# EAGLE design Mega8 (EAGLE 7.4.0)
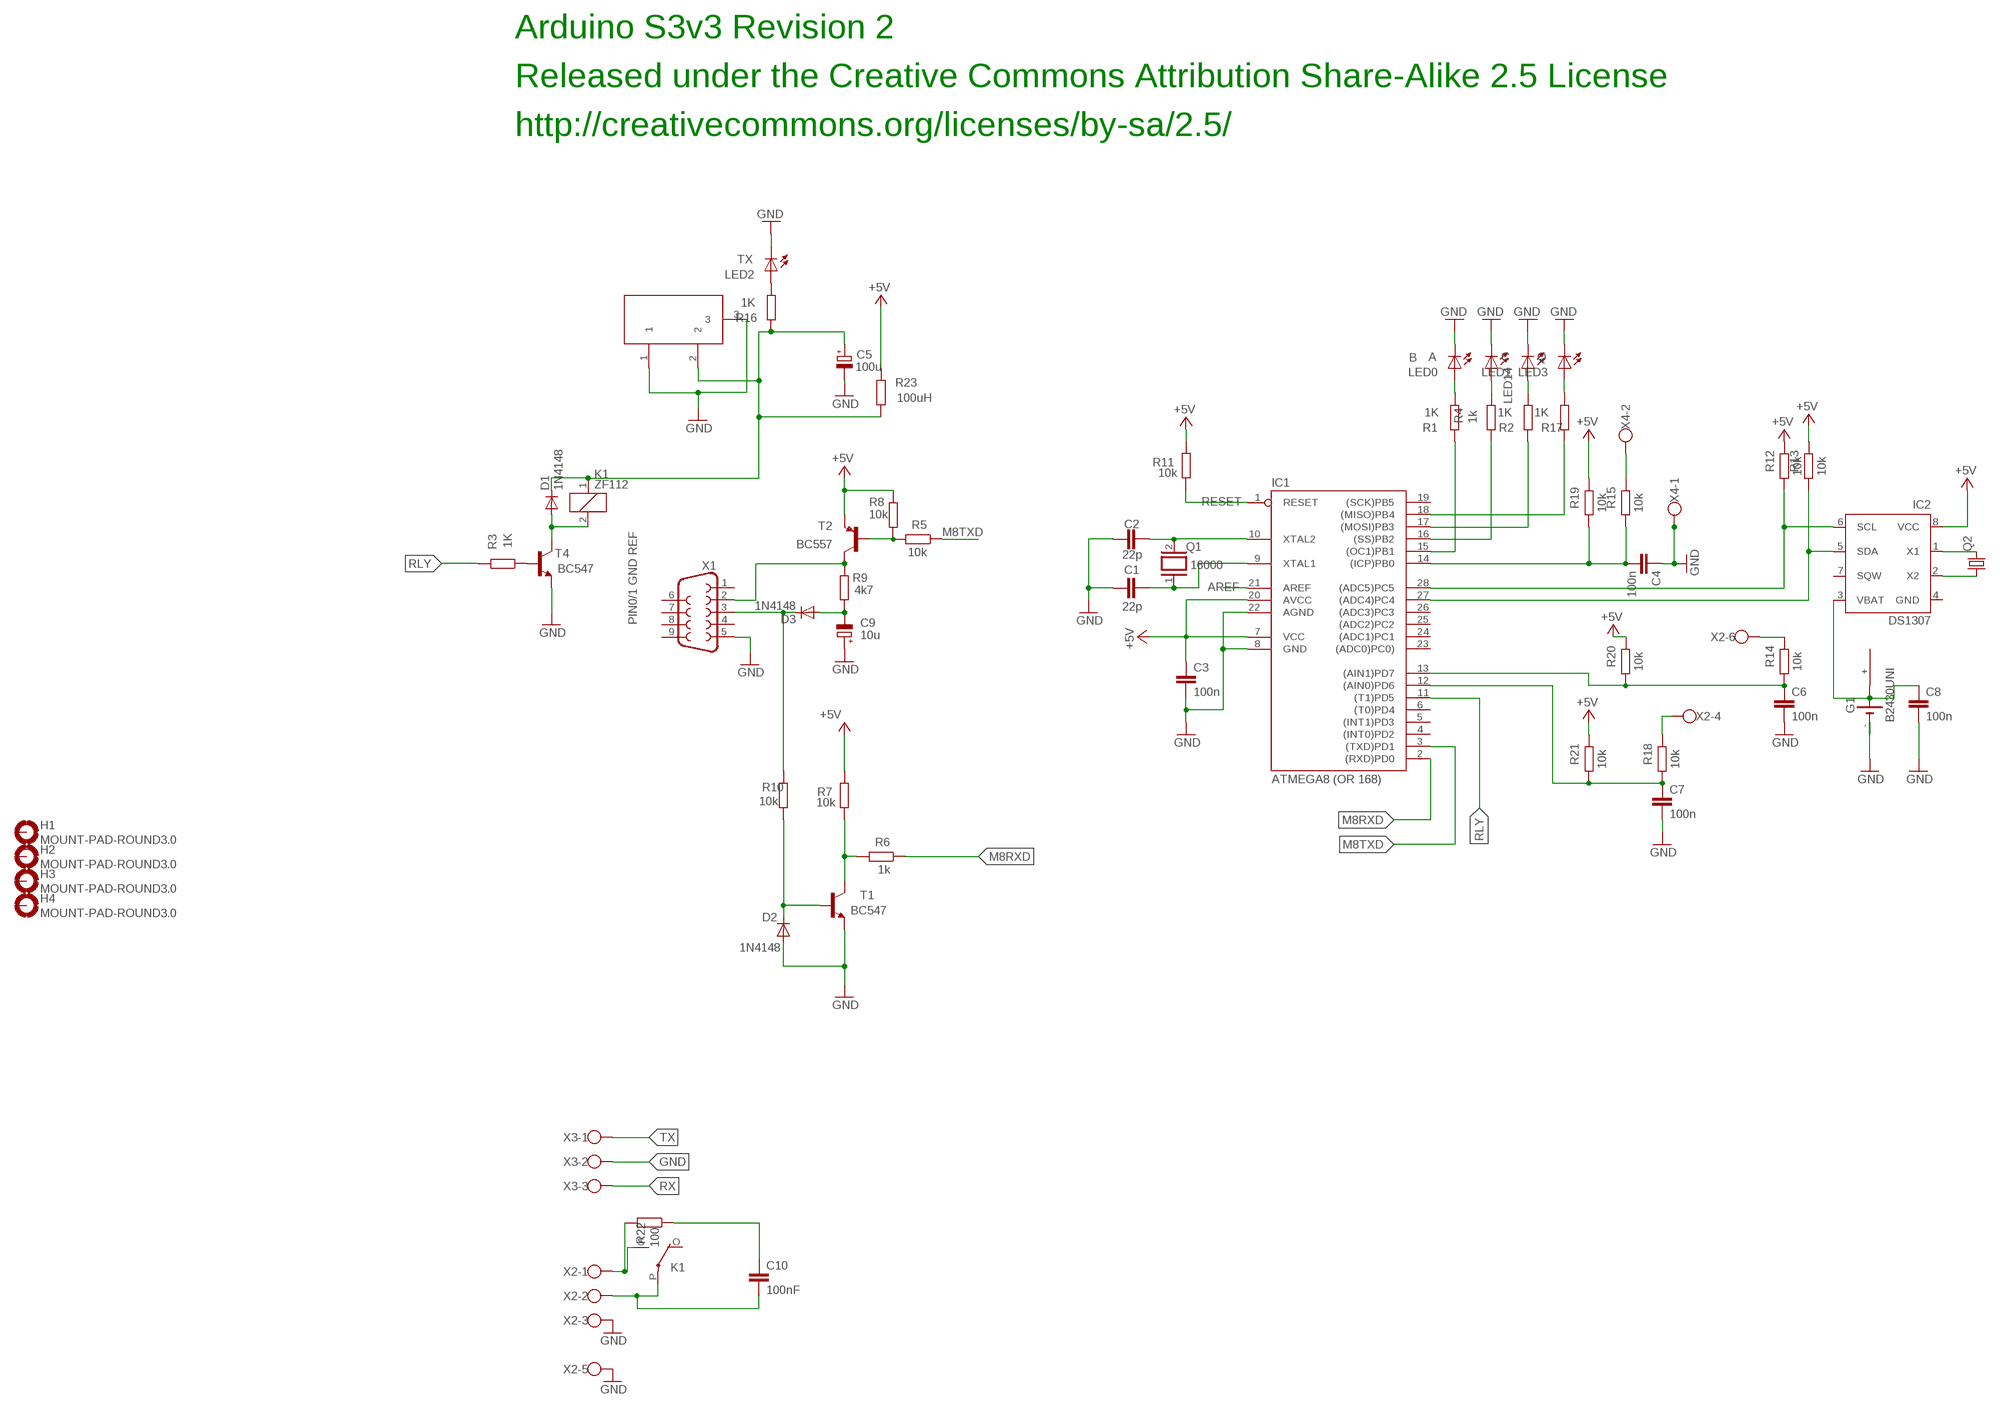
[diagram p0: schematic, sheet 1]

## Parts
C1  22p  C-EU050-025X075  [C050-025X075]
C2  22p  C-EU050-025X075  [C050-025X075]
C3  100n  C-EU050-025X075  [C050-025X075]
C4  100n  C-EU050-025X075  [C050-025X075]
C5  100u  CPOL-EUE3.5-8  [E3,5-8]
C6  100n  C-EU050-025X075  [C050-025X075]
C7  100n  C-EU050-025X075  [C050-025X075]
C8  100n  C-EU050-025X075  [C050-025X075]
C9  10u  CPOL-EUE5-6  [E5-6]
C10  100nF  C-EU102-043X133  [C102-043X133]
D1  1N4148  [DO35-10]
D2  1N4148  [DO35-10]
D3  1N4148  [DO35-10]
DC1  DC21MMX  [DC-21MM]
G1  B2430UNI  [B2430UNI]
H1  MOUNT-PAD-ROUND3.0  [3,0-PAD]
H2  MOUNT-PAD-ROUND3.0  [3,0-PAD]
H3  MOUNT-PAD-ROUND3.0  [3,0-PAD]
H4  MOUNT-PAD-ROUND3.0  [3,0-PAD]
IC1  ATMEGA8 (OR 168)  AT90S4433P  [DIL28-3]
IC2  DS1307  [DIL08]
K1  ZF112  [ZF112]
LED0  A  LED3MM  [LED3MM]
LED1  C  LED3MM  [LED3MM]
LED2  TX  LED3MM  [LED3MM]
LED3  Q  LED3MM  [LED3MM]
LED14  B  LED3MM  [LED3MM]
Q1  16000  XTAL  [Q]
Q2  CRYSTALTC26H  [TC26H]
R1  1K  R-EU_0207/10  [0207/10]
R2  1K  R-EU_0207/10  [0207/10]
R3  1K  R-EU_0207/10  [0207/10]
R4  1k  R-EU_0207/10  [0207/10]
R5  10k  R-EU_0207/10  [0207/10]
R6  1k  R-EU_0207/10  [0207/10]
R7  10k  R-EU_0207/10  [0207/10]
R8  10k  R-EU_0207/10  [0207/10]
R9  4k7  R-EU_0207/10  [0207/10]
R10  10k  R-EU_0207/10  [0207/10]
R11  10k  R-EU_0207/10  [0207/10]
R12  10k  R-EU_0207/10  [0207/10]
R13  10k  R-EU_0207/10  [0207/10]
R14  10k  R-EU_0207/10  [0207/10]
R15  10k  R-EU_0207/10  [0207/10]
R16  1K  R-EU_0207/10  [0207/10]
R17  1K  R-EU_0207/10  [0207/10]
R18  10k  R-EU_0207/10  [0207/10]
R19  10k  R-EU_0207/10  [0207/10]
R20  10k  R-EU_0207/10  [0207/10]
R21  10k  R-EU_0207/10  [0207/10]
R22  100  R-EU_0207/10  [0207/10]
R23  100uH  R-EU_0207/10  [0207/10]
T1  BC547  [TO92]
T2  BC557  BC557B-PNP-TO92-EBC  [TO92-EBC]
T4  BC547  [TO92]
X1  F09H  [F09H]
X2  W237-6  [W237-6]
X3  W237-103  [W237-103]
X4  W237-102  [W237-102]

## Nets
+5V [power]: C3.1 IC1.7(VCC) IC1.20(AVCC) IC2.8(VCC) R7.2 R8.1 R11.2 R12.1 R13.1 R19.1 R20.1 R21.1 R23.2 T2.E
AREF: IC1.21(AREF)
GND: C1.1 C2.1 C3.2 C4.1 C5.- C6.2 C7.2 C8.2 C9.+ D2.A DC1.1 DC1.3 G1.- G1.-@1(-) IC1.8(GND) IC1.22(AGND) LED0.K(C) LED1.K(C) LED2.K(C) LED3.K(C) LED14.K(C) T1.1(E) T4.1(E) X1.5 X2.3 X2.5 X3.2 X4.1
M8RXD: IC1.2((RXD)PD0) R6.1
M8TXD: IC1.3((TXD)PD1) R5.1
N$1: R3.1 T4.2(B)
N$2: C9.- D3.A R9.1
N$3: LED14.A R4.1
N$4: D1.A K1.2 T4.3(C)
N$5: R18.1 X2.4
N$6: C1.2 IC1.9(XTAL1) Q1.1
N$7: C2.2 IC1.10(XTAL2) Q1.2
N$8: K1.S(2:S) R22.2 X2.1
N$9: C10.2 K1.P(2:P) X2.2
N$10: IC1.28((ADC5)PC5) IC2.6(SCL) R12.2
N$11: IC1.27((ADC4)PC4) IC2.5(SDA) R13.2
N$12: C8.1 G1.+@4(+) IC2.3(VBAT)
N$13: C4.2 IC1.14((ICP)PB0) R15.2 R19.2
N$14: C6.1 IC1.13((AIN1)PD7) R14.2 R20.2
N$15: R14.1 X2.6
N$16: IC1.15((OC1)PB1) R1.2
N$17: IC1.16((SS)PB2) R4.2
N$18: IC1.17((MOSI)PB3) R2.2
N$19: LED2.A R16.1
N$20: C7.1 IC1.12((AIN0)PD6) R18.2 R21.2
N$21: LED3.A R17.1
N$22: IC1.18((MISO)PB4) R17.2
N$23: R15.1 X4.2
N$24: IC2.1(X1) Q2.2
N$25: IC2.2(X2) Q2.1
N$26: R6.2 R7.1 T1.3(C)
N$27: R5.2 R8.2 T2.B
N$28: C10.1 R22.1
N$29: D2.C R10.1 T1.2(B)
N$30 [power]: C5.+ D1.C DC1.2 K1.1 R16.2 R23.1
N$32: LED1.A R2.1
N$33: LED0.A R1.1
RESET: IC1.1(RESET) R11.1
RLY: IC1.11((T1)PD5) R3.2
RX: D3.C R10.2 X1.3 X3.3
TX: R9.2 T2.C X1.2 X3.1
Unconnected: G1.+ G1.+@1(+) G1.+@2(+) G1.+@3(+) H1.B3,0(MOUNT) H2.B3,0(MOUNT) H3.B3,0(MOUNT) H4.B3,0(MOUNT) IC1.4((INT0)PD2) IC1.5((INT1)PD3) IC1.6((T0)PD4) IC1.19((SCK)PB5) IC1.23((ADC0)PC0)) IC1.24((ADC1)PC1) IC1.25((ADC2)PC2) IC1.26((ADC3)PC3) IC2.7(SQW) K1.O(2:O) X1.1 X1.4 X1.6 X1.7 X1.8 X1.9

## Notes on the sheet
- Arduino S3v3 Revision 2
- Released under the Creative Commons Attribution Share-Alike 2.5 License
- http://creativecommons.org/licenses/by-sa/2.5/
- PIN0/1 GND REF

## Power pins joined to a net without a drawn wire
GND: IC2.4(GND)

## Library data of the parts
C1-C4 C6-C8 C10 = rcl:C-EU: CAPACITOR, European symbol
C5 C9 = rcl:CPOL-EU: POLARIZED CAPACITOR, European symbol
D1-D3 = diode:1N4148: DIODE high speed (Philips)
DC1 = powersupply:DC21MM
G1 = battery:B2430UNI: LI BATTERY
H1-H4 = holes:MOUNT-PAD-ROUND: MOUNTING PAD, round
IC1 = atmel:AT90S4433: MICROCONTROLLER 4 Kbytes FLASH 128 bytes SRAM 256 bytes EEPROM UART 6-channel 10 bit ADC
IC2 = ds1307_pcf8583:DS1307: I2C-Bus CLOCK/CALENDAR
K1 = relay:ZF112: RELAY 1 x switch; OC_FARNELL: unknown; OC_NEWARK: unknown
LED0 LED1-LED3 LED14 = led:LED: LED OSRAM: - CHIPLED LG R971, LG N971, LY N971, LG Q971, LY Q971, LO R971, LY R971 LH N974, LH R974 LS Q976, LO Q976, LY Q976 LO Q996 - Hyper CHIPLED LW Q18S LB Q993, LB Q99A, LB R99A - SideLED LS A670, LO A670, LY A670, LG A670, LP A670 LB A673, LV A673, LT A673, LW A673 LH A674 LY A675 LS A676, LA A676, LO A676, LY A676, LW A676 LS A679, LY A679, LG A679 - Hyper Micro SIDELED® LS Y876, LA Y876, LO Y876, LY Y876 LT Y87S - SmartLED LW L88C, LW L88S LB L89C, LB L89S, LG L890 LS L89K, LO L89K, LY L89K LS L896, LA L896, LO L896, LY L896 - TOPLED LS T670, LO T670, LY T670, LG T670, LP T670 LSG T670, LSP T670, LSY T670, LOP T670, LYG T670 LG T671, LOG T671, LSG T671 LB T673, LV T673, LT T673, LW T673 LH T674 LS T676, LA T676, LO T676, LY T676, LB T676, LH T676, LSB T676, LW T676 LB T67C, LV T67C, LT T67C, LS T67K, LO T67K, LY T67K, LW E67C LS E67B, LA E67B, LO E67B, LY E67B, LB E67C, LV E67C, LT E67C LW T67C LS T679, LY T679, LG T679 LS T770, LO T770, LY T770, LG T770, LP T770 LB T773, LV T773, LT T773, LW T773 LH T774 LS E675, LA E675, LY E675, LS T675 LS T776, LA T776, LO T776, LY T776, LB T776 LHGB T686 LT T68C, LB T68C - Hyper Mini TOPLED® LB M676 - Mini TOPLED Santana® LG M470 LS M47K, LO M47K, LY M47K Source: http://www.osram.convergy.de/
Q1 = special:XTAL: CRYSTAL
Q2 = crystal:CRYSTAL: CRYSTAL; OC_FARNELL: unknown; OC_NEWARK: unknown
R1-R23 = rcl:R-EU_: RESISTOR, European symbol
T1 T4 = transistor:BC547: NPN TRANSISTOR
T2 = transistor:*-PNP-: PNP Transistror
X1 = con-subd:F09: SUB-D
X2 = con-wago-500:W237-6: WAGO SCREW CLAMP; OC_FARNELL: unknown; OC_NEWARK: unknown
X3 = con-wago-500:W237-103: WAGO SCREW CLAMP; MPN: 237-103; OC_FARNELL: unknown; OC_NEWARK: 18M7116
X4 = con-wago-500:W237-102: WAGO SCREW CLAMP; MPN: 237-102; OC_FARNELL: unknown; OC_NEWARK: 70K9898

## Net classes
1 power: width 0.61 mm

## Board
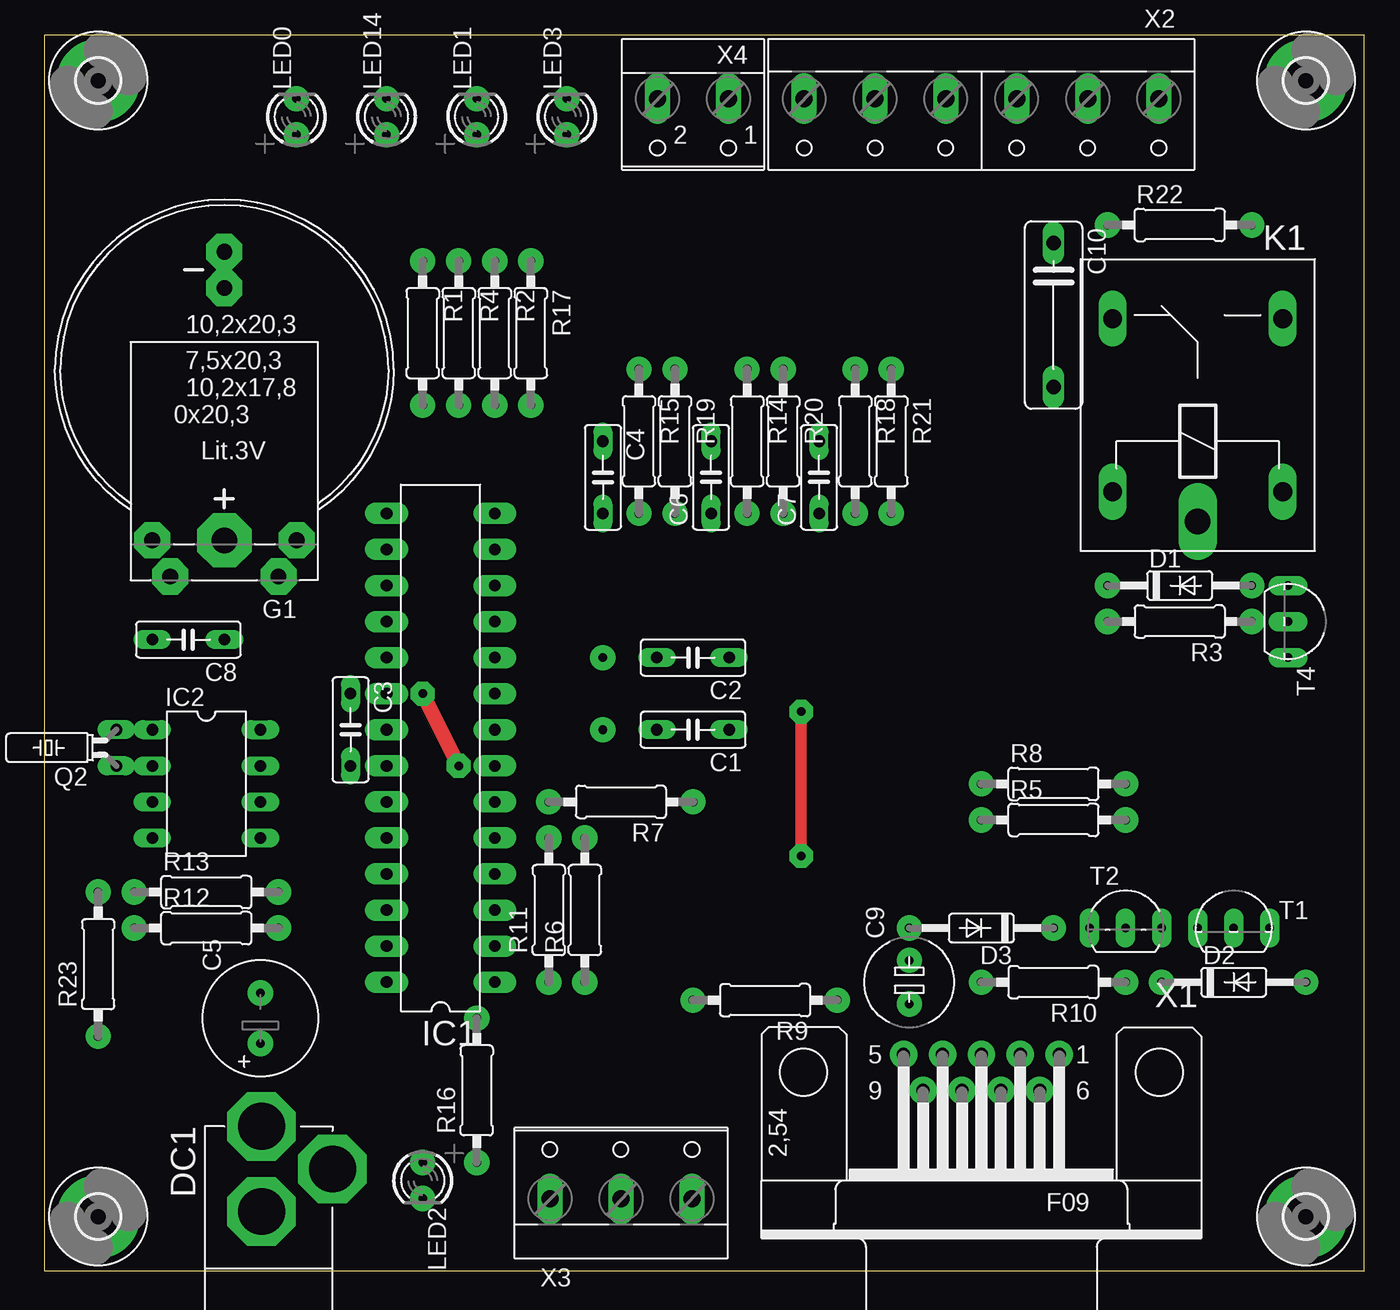
[diagram p1: board, top side]
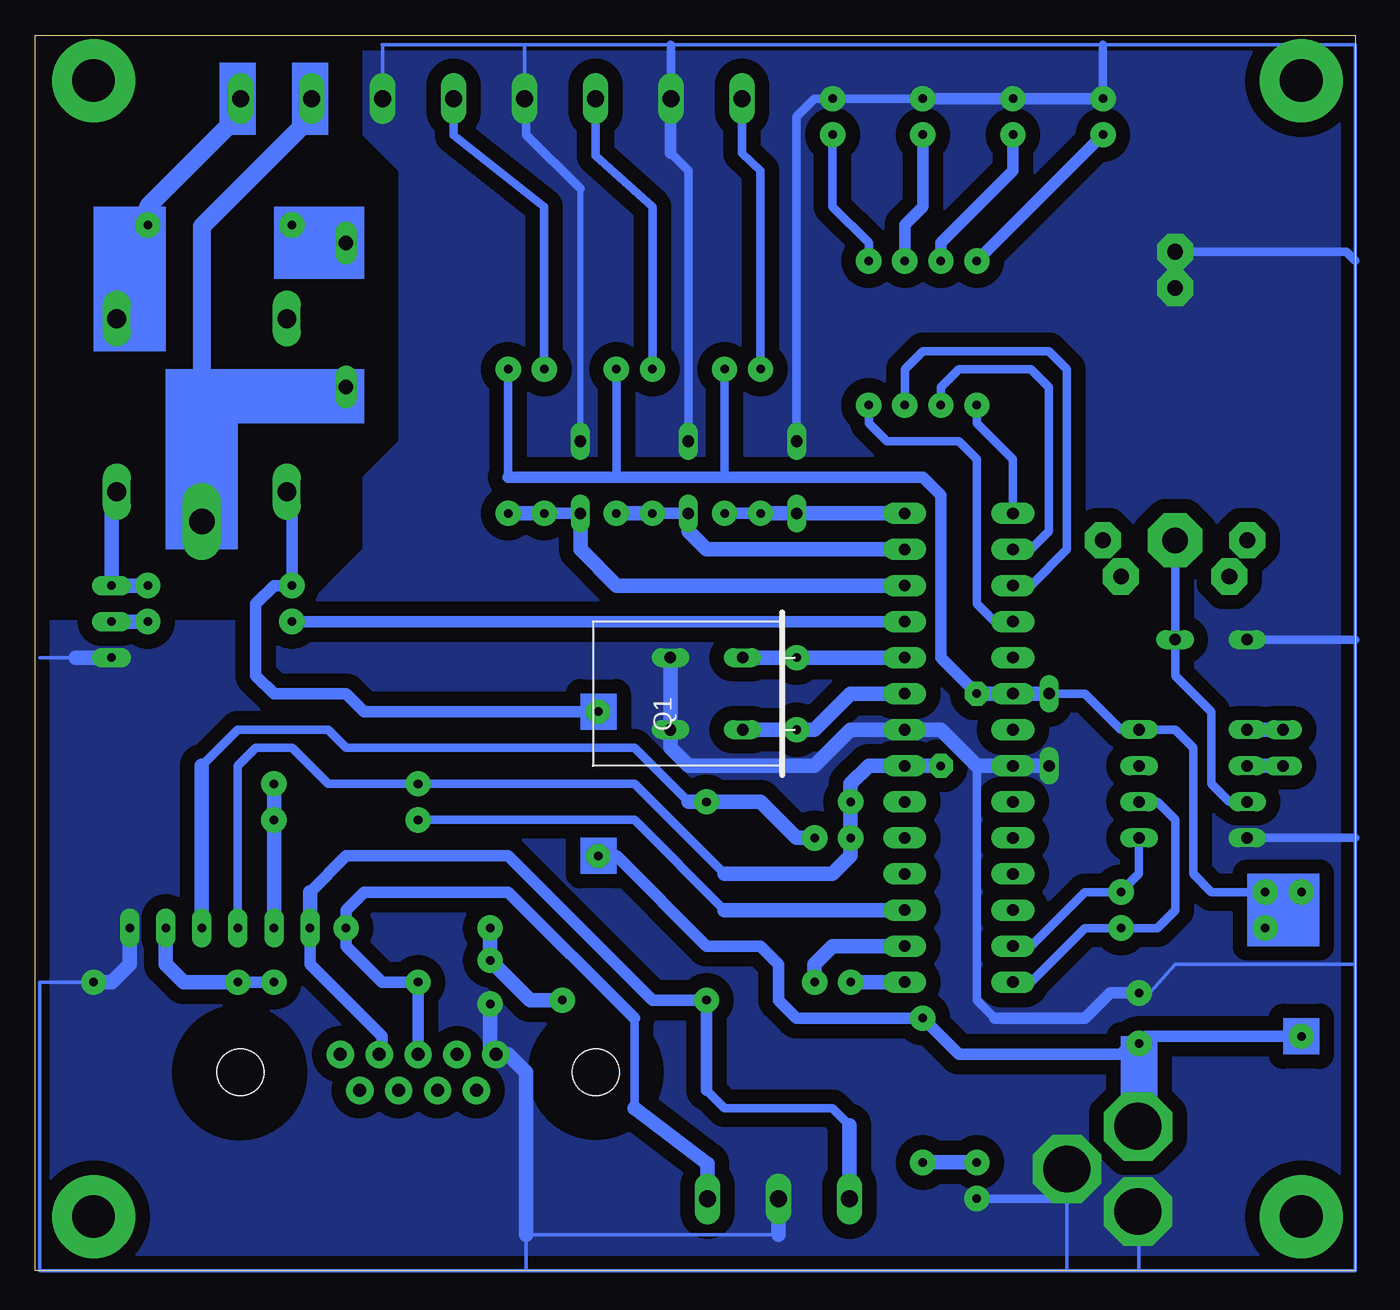
[diagram p2: board, bottom side, seen from below]

Size 93 x 87 mm. Coordinates in mm from the lower left corner, seen from the top.
Outline: 0,0 93,0 93,87 0,87 0,0
Copper layers (1*16): Top 0.035mm / dielectric 1.5mm / Bottom 0.035mm
Design rules "default": minimum track width 10mil, minimum drill 24mil, track to track 8mil, track to pad 8mil, pad to pad 8mil, via to via 8mil, smd to smd 8mil, copper to edge 40mil, drill to drill 8mil, minimum pad ring 10mil, minimum via ring 8mil, stop-mask expansion 4mil, vias tented up to drill 0mil, thermal gap 10mil

### Footprints (pad centres in the part's own frame; a part is rotated, then mirrored left to right if it is on the bottom)
C050-025X075 = drill 0.813 long: 1 -2.54,0; 2 2.54,0
E3,5-8 = drill 0.6 pad 1.778: + -1.778,0; - 1.778,0
E5-6 = drill 0.6 pad 1.778: + -1.54,0; - 1.54,0
C102-043X133 = drill 1.016 long: 1 -5.08,0; 2 5.08,0
DO35-10 = drill 0.6 pad 1.778: A 5.08,0; C -5.08,0
DC-21MM = drill 3.302 pad 4.826 octagon: 1 -5.08,-3.353; 2 -0.076,-6.35; 3 -0.076,-0.356
B2430UNI = drill 1.118 pad 2.54 octagon: + 3.81,14.605; +@1 -3.81,14.605; +@2 -5.08,12.065; +@3 5.08,12.065; - 0,-5.715; -@1 0,-8.255 | drill 1.803 pad 3.81 octagon: +@4 0,12.065
3,0-PAD = drill 3 pad 5.842: B3,0 0,0
DIL28-3 = drill 0.813 pad 1.524 long: 1 -16.51,-3.81; 2 -13.97,-3.81; 3 -11.43,-3.81; 4 -8.89,-3.81; 5 -6.35,-3.81; 6 -3.81,-3.81; 7 -1.27,-3.81; 8 1.27,-3.81; 9 3.81,-3.81; 10 6.35,-3.81; 11 8.89,-3.81; 12 11.43,-3.81; 13 13.97,-3.81; 14 16.51,-3.81; 15 16.51,3.81; 16 13.97,3.81; 17 11.43,3.81; 18 8.89,3.81; 19 6.35,3.81; 20 3.81,3.81; 21 1.27,3.81; 22 -1.27,3.81; 23 -3.81,3.81; 24 -6.35,3.81; 25 -8.89,3.81; 26 -11.43,3.81; 27 -13.97,3.81; 28 -16.51,3.81
DIL08 = drill 0.813 long: 1 -3.81,-3.81; 2 -1.27,-3.81; 3 1.27,-3.81; 4 3.81,-3.81; 5 3.81,3.81; 6 1.27,3.81; 7 -1.27,3.81; 8 -3.81,3.81
ZF112 = drill 1.321 long: 1 -6.096,5.994; 2 -6.096,-5.994; O 6.096,5.994; S 6.096,-5.994 | drill 1.803 long: P -8.204,0
LED3MM = drill 0.6 pad 1.778: A -1.27,0; K 1.27,0
Q = drill 0.6 pad 1.778: 1 -2.54,-7.62; 2 2.54,-7.62
TC26H = drill 0.813 long: 1 -1.27,0; 2 1.27,0
0207/10 = drill 0.6 pad 1.778: 1 -5.08,0; 2 5.08,0
TO92 = drill 0.6 pad 1.372 long: 1 2.54,0; 2 0,0; 3 -2.54,0
TO92-EBC = drill 0.6 pad 1.372 long: B 0,-1.27; C -2.54,-1.27; E 2.54,-1.27
F09H = drill 0.9 pad 1.93: 1 -5.486,-1.27; 2 -2.743,-1.27; 3 0,-1.27; 4 2.743,-1.27; 5 5.486,-1.27; 6 -4.115,1.27; 7 -1.372,1.27; 8 1.372,1.27; 9 4.115,1.27 | hole 3.302: -12.522,0; 12.522,0
W237-6 = drill 1.194 long: 1 -12.5,-1.27; 2 -7.5,-1.27; 3 -2.5,-1.27; 4 2.5,-1.27; 5 7.5,-1.27; 6 12.5,-1.27
W237-103 = drill 1.194 long: 1 -5,-1.29; 2 0,-1.29; 3 5,-1.29
W237-102 = drill 1.194 long: 1 -2.5,-1.27; 2 2.5,-1.27

### Placement (x,y rotation side)
C1  45.72,38.1 180 top
C2  45.72,43.18 180 top
C3  21.59,38.1 270 top
C4  39.37,55.88 270 top
C5  15.24,17.78 90 top
C6  46.99,55.88 90 top
C7  54.61,55.88 90 top
C8  10.16,44.45 180 top
C9  60.96,20.32 90 top
C10  71.12,67.31 270 top
D1  80.01,48.26 0 top
D2  83.82,20.32 0 top
D3  66.04,24.13 180 top
DC1  15.24,3.81 180 top
G1  12.7,63.5 180 top
H1  88.9,3.81 0 top
H2  88.9,83.82 0 top
H3  3.81,83.82 0 top
H4  3.81,3.81 0 top
IC1  27.94,36.83 90 top
IC2  11.43,34.29 270 top
K1  81.28,60.96 90 top
LED0  17.78,81.28 90 top
LED1  30.48,81.28 90 top
LED2  26.67,6.35 270 top
LED3  36.83,81.28 90 top
LED14  24.13,81.28 90 top
Q1  46.99,40.64 90 bottom
Q2  5.08,36.83 90 top
R1  26.67,66.04 270 top
R2  31.75,66.04 270 top
R3  80.01,45.72 180 top
R4  29.21,66.04 270 top
R5  71.12,31.75 0 top
R6  38.1,25.4 90 top
R7  40.64,33.02 180 top
R8  71.12,34.29 0 top
R9  50.8,19.05 180 top
R10  71.12,20.32 180 top
R11  35.56,25.4 90 top
R12  11.43,24.13 0 top
R13  11.43,26.67 0 top
R14  49.53,58.42 270 top
R15  41.91,58.42 270 top
R16  30.48,12.7 90 top
R17  34.29,66.04 270 top
R18  57.15,58.42 270 top
R19  44.45,58.42 270 top
R20  52.07,58.42 270 top
R21  59.69,58.42 270 top
R22  80.01,73.66 0 top
R23  3.81,21.59 90 top
T1  83.82,24.13 0 top
T2  76.2,25.4 0 top
T4  87.63,45.72 270 top
X1  66.04,13.97 180 top
X2  66.04,81.28 180 top
X3  40.64,6.35 0 top
X4  45.72,81.28 180 top

### Tracks (layer width: path | path; a pad name or v marks a point on that pad's centre or on a via)
+5V  (via drill 0.6 pad 1.68)
  Top 1.016: v26.67,40.64 v29.21,35.56
  Bottom 0.61: 44.45,27.94 50.8,34.29 R8.1 72.39,34.29 74.93,36.83 77.47,36.83 78.74,35.56 T2.E | C3.1 19.05,40.64 16.51,38.1 IC2.8 12.7,38.1 11.43,36.83 11.43,27.94 10.16,26.67 R13.1 R12.1 | R19.1 44.45,55.88 | R20.1 52.07,55.88 | R21.1 59.69,55.88
  Bottom 0.813: 59.69,55.88 52.07,55.88 44.45,55.88 30.48,55.88 29.21,54.61 29.21,43.18 v26.67,40.64 | R23.2 R13.1
  Bottom 1.016: v26.67,40.64 IC1.20 C3.1 | v29.21,35.56 IC1.7 34.29,35.56 35.56,34.29 R7.2 R11.2 35.56,29.21 36.83,27.94 44.45,27.94
GND
  Bottom 0.254: DC1.3 15.24,4.17 15.24,0 | 15.24,0 20.32,0 | 20.32,0 58.42,0 | 58.42,0 92.71,0 92.71,20.32 D2.A | 58.42,86.36 68.58,86.36 68.54,86.32 X2.3 | 58.42,86.36 48.26,86.36 17.78,86.36 0,86.36 0,71.12 0,44.45 0,30.48 0,21.59 | 0,21.59 0,0 15.24,0 | DC1.1 20.32,5.08 20.32,0 | 90.17,43.18 92.71,43.18 | C5.- 14.48,19.56 12.7,21.59 0,21.59 | X2.5 58.54,86.24 58.42,86.36 | 40.64,2.54 58.42,2.54 58.42,0
  Bottom 0.406: 48.26,78.74 48.26,78.7 | C7.2 54.61,76.2
  Bottom 0.61: 25.4,17.78 26.67,19.05 26.67,35.56 | IC2.4 0,30.48 | LED0.K 17.78,86.36 | G1.- G1.-@1 | G1.-@1 12.7,72.39 | G1.-@1 0.64,71.75 0,71.12 | LED2.K 20.32,5.08 | LED1.K LED3.K 38.1,82.55 39.37,81.28 C4.1 | X4.1 48.22,86.32 48.26,86.36 | C8.2 0,44.45 | 54.61,76.2 58.42,80.01 58.42,82.43 X2.5 | C6.2 46.99,77.47 48.26,78.74
  Bottom 0.813: LED1.K LED14.K LED0.K | C5.- 17.27,19.56 19.05,17.78 25.4,17.78 | 48.26,78.7 48.26,82.51 X4.1
  Bottom 1.016: T1.1 86.36,21.59 87.63,20.32 D2.A | 58.42,2.54 58.42,13.97 59.69,15.24 X1.5 60.96,15.65 C9.+ | C3.2 IC1.22 26.67,35.56 29.21,38.1 IC1.8 35.56,38.1 38.1,35.56 46.99,35.56 48.26,36.83 C1.1 C2.1 | X3.2 40.64,2.54 | T4.1 90.17,43.18 | 47.11,58.54 C6.2
  pour Bottom (isolate 1.016, no thermals): 0,86.36 0,0 92.71,0 92.71,45.72 74.93,45.72 69.85,50.8 69.85,55.88 67.31,58.42 67.31,77.47 69.85,80.01 69.85,86.36
M8RXD
  Bottom 1.016: IC1.2 36.83,22.86 38.1,21.59 R6.1
M8TXD
  Bottom 0.61: 44.45,25.4 50.8,31.75 R5.1
  Bottom 1.016: IC1.3 44.45,25.4
N$1
  Bottom 1.016: T4.2 R3.1
N$2
  Bottom 1.016: R9.1 58.15,19.05 C9.- D3.A
N$3
  Bottom 0.813: R4.1 29.21,72.39 24.13,77.47 LED14.A
N$4
  Bottom 1.016: K1.2 87.63,54.86 T4.3 D1.A
N$5
  Bottom 0.61: X2.4 63.54,79.97 57.15,74.93 R18.1
N$6
  Bottom 1.016: IC1.9 35.56,40.64 38.1,38.1 Q1.1 C1.2
N$7
  Bottom 1.016: IC1.10 Q1.2 C2.2
N$8
  Bottom 1.27: X2.1 78.74,82.35 78.74,81.28 85.09,74.93 R22.2 85.09,69.24 K1.S
N$9
  Bottom 1.27: X2.2 73.54,81.28 81.28,73.54 81.28,62.23 | 81.28,62.23 K1.P | C10.2 81.28,62.23
N$10
  Bottom 0.61: IC1.28 22.86,20.32 19.05,24.13 R12.2 13.97,24.13 12.7,25.4 12.7,31.75 13.97,33.02 IC2.6
N$11
  Bottom 0.61: IC1.27 22.86,22.86 19.05,26.67 R13.2 15.24,27.94 IC2.5
N$12
  Bottom 0.61: IC2.3 8.89,33.02 10.16,34.29 10.16,39.37 12.7,41.91 C8.1 G1.+@4
N$13
  Bottom 0.813: R15.2 R19.2
  Bottom 1.016: IC1.14 C4.2 R15.2
N$14
  Bottom 0.813: R14.2 C6.1
  Bottom 1.016: R14.2 R20.2 | C6.1 46.99,52.07 45.72,50.8 IC1.13
N$15
  Bottom 0.61: X2.6 53.54,78.54 49.53,74.93 R14.1
N$16
  Bottom 0.61: R1.2 26.67,59.69 24.13,57.15 IC1.15
N$17
  Bottom 0.61: R4.2 29.21,62.23 27.94,63.5 22.86,63.5 21.59,62.23 21.59,52.07 22.86,50.8 IC1.16
N$18
  Bottom 0.61: R2.2 31.75,63.5 30.48,64.77 21.59,64.77 20.32,63.5 20.32,50.8 22.86,48.26 IC1.17
N$19
  Bottom 1.016: R16.1 LED2.A
N$20
  Bottom 0.813: C7.1 R18.2
  Bottom 1.016: R18.2 R21.2 | C7.1 54.61,50.8 52.07,48.26 IC1.12
N$21
  Bottom 0.61: LED3.A 36.83,74.93 34.29,72.39 R17.1
N$22
  Bottom 0.61: IC1.18 25.4,45.72 26.67,46.99 26.67,57.15 27.94,58.42 33.02,58.42 34.29,59.69 R17.2
N$23
  Bottom 0.61: X4.2 43.22,78.7 41.91,77.47 R15.1
N$24
  Bottom 1.016: IC2.1 Q2.2
N$25
  Bottom 1.016: IC2.2 Q2.1
N$26
  Bottom 0.61: 46.99,33.02 50.8,36.83 71.12,36.83 72.39,38.1 78.74,38.1 81.28,35.56
  Bottom 1.016: 81.28,35.56 T1.3 | R6.2 39.37,30.48 41.91,33.02 R7.1 46.99,33.02
N$27
  Bottom 1.016: T2.B R5.2 R8.2
N$28
  Bottom 1.27: C10.1 72.39,72.39 73.66,73.66 R22.1
N$29
  Bottom 0.813: R10.1 D2.C
  Bottom 1.016: T1.2 83.82,21.59 82.55,20.32 D2.C
N$30  (via drill 0.6 pad 1.68)
  Top 0.813: v53.34,39.37 v53.34,29.21
  Bottom 0.813: R23.1 14.73,16.51 C5.+ | C5.+ 15.75,16 16.51,15.24 27.94,15.24 R16.2 39.37,17.78 40.64,19.05 40.64,21.59 41.91,22.86 45.72,22.86 52.07,29.21 v53.34,29.21 | K1.1 74.93,54.51 D1.C 76.2,48.26 77.47,46.99 77.47,41.91 76.2,40.64 71.12,40.64 69.85,39.37 v53.34,39.37 | DC1.2 15.32,15.93 C5.+
N$32
  Bottom 0.813: R2.1 31.75,73.66 30.48,74.93 LED1.A
N$33
  Bottom 0.813: R1.1 LED0.A
RESET
  Bottom 1.016: IC1.1 R11.1
RLY
  Bottom 0.813: IC1.11 R3.2
RX
  Bottom 0.61: 50.8,11.43 50.8,17.78
  Bottom 0.813: X1.3 R10.2 68.58,20.32 71.12,22.86 D3.C 71.12,25.4 69.85,26.67 59.69,26.67 50.8,17.78
  Bottom 1.016: X3.3 45.64,7.54 50.8,11.43
TX
  Bottom 0.61: 35.64,10.24 36.83,11.43 44.45,11.43 45.72,12.7
  Bottom 0.813: 45.72,12.7 R9.2 49.53,19.05 59.69,29.21 71.12,29.21 73.66,26.67 | 68.58,15.44 68.58,16.51 73.66,21.59 T2.C
  Bottom 1.016: 68.58,15.24 X1.2 68.58,15.44 | X3.1 35.64,10.24 | 73.66,26.67 T2.C
(copper drawn outside any net)
  shapes: Bottom area x11